# Altium schematic sheet Main_Megamind.SchDoc
size A4; SheetNumber: 4; SheetTotal: 4
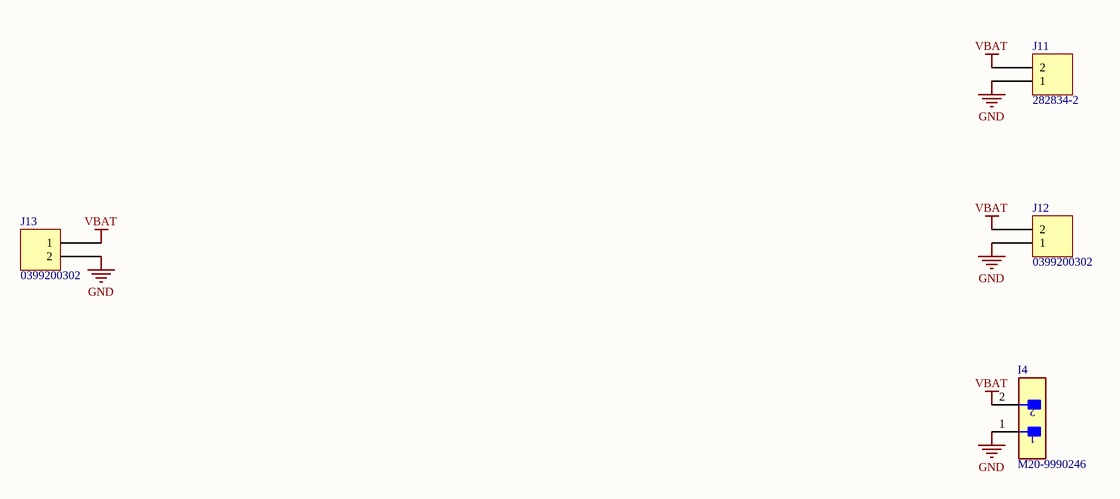
[diagram p0: Main_Megamind.SchDoc]

## Parts
I4  M20-9990246  [FP-M20-9990246-MFG]
J11  282834-2  [TE 282834-2]
J12  0399200302  [MOLEX 0399200302]
J13  0399200302  [MOLEX 0399200302]

## Nets
GND: I4.1 J11.1 J12.1 J13.2
VBAT: I4.2 J11.2 J12.2 J13.1

## Library data of the parts
I4 = CMP-15831-000009-1: CONN HEADER VERT 2POS 2.54MM; Manufacturer: Harwin; Conn Gender: Male; Conn Orientation: Vertical; Number Of Contacts: 2; Current Rating: 3A; ComponentLink2URL: https://cdn.harwin.com/pdfs/M20-999.pdf; ComponentLink2Description: Datasheet; Package: M20-9990246; Temperature: -40°C to +105°C; Octopart: https://octopart.com/m20-9990246-harwin-2590635; Mouser Description: 2.54mm (0.1") Pitch SIL Vertical PC Tail Pin Header, 6.1mm mating pin height, tin, 2 contacts; Temperature Range High: +105°C; Device Class L1: Connectors; RoHS: TRUE; Automotive: No; Height: 8.99mm; Number Of Rows: 1; Contact Material: Tin,Nickel; Category: Conn; Pitch: 2.54mm; Lead Free: Yes; Digikey Description: CONN HEADER VERT 2POS 2.54MM; Manufacturer Part Number: M20-9990246; Temperature Range Low: -40°C; Device Class L3: unset; Device Class L2: Headers and Wire Housings
J11 = 282834-2: TERM BLK 2P SIDE ENT 2.54MM PCB; Manufacturer: TE Connectivity AMP Connectors; Current: 10A; Mating Orientation: Horizontal with Board; Number of Levels: 1; Pitch: 0.100" (2.54mm); Positions Per Level: 2; Voltage: 150V; Wire Gauge: 16-30 AWG; Wire Termination: Screw - Rising Cage Clamp; Part Number: 282834-2; Color: Green; ComponentLink1Description: Datasheet; ComponentLink1URL: https://www.te.com/commerce/DocumentDelivery/DDEController?Action=srchrtrv&DocNm=282834&DocType=Customer+Drawing&DocLang=English; ComponentLink2Description: DigiKey Link; ComponentLink2URL: http://digikey.com/product-detail/en/te-connectivity-amp-connectors/282834-2/A98333-ND/1150135; LastUpdated: 2020-01-15 4:15:38 AM; Lifecycle Status: Active; Minimum Order: 1; Mounting Type: Through Hole; Packaging: Bulk; Part Status: Active; Price: 0.88; Series: Buchanan; Supplier 1: DigiKey; Supplier Part Number 1: A98333-ND
J12 J13 = 0399200302: TERM BLK 2P SIDE ENTRY 15MM PCB; Manufacturer: Molex; Current: 115 A; Mating Orientation: Horizontal with Board; Number of Levels: 1; Pitch: 0.591" (15.00mm); Positions Per Level: 2; Voltage: 600 V; Wire Gauge: 1-8 AWG; Wire Termination: Screw - Rising Cage Clamp; Part Number: 0399200302; Color: Black; ComponentLink1Description: Datasheet; ComponentLink1URL: https://www.molex.com/pdm_docs/sd/399200302_sd.pdf; ComponentLink2Description: DigiKey Link; ComponentLink2URL: https://www.digikey.com/en/products/detail/molex/0399200302/3316297; LastUpdated: 2022-03-05 4:30:55 PM; Lifecycle Status: Active; Minimum Order: 1; Mounting Type: Through Hole; Packaging: Bulk; Part Status: Active; Price: 5.90; Series: Eurostyle 39920; Supplier 1: DigiKey; Supplier Part Number 1: WM20114-ND